# Altium project LED_Driver.PrjPcb
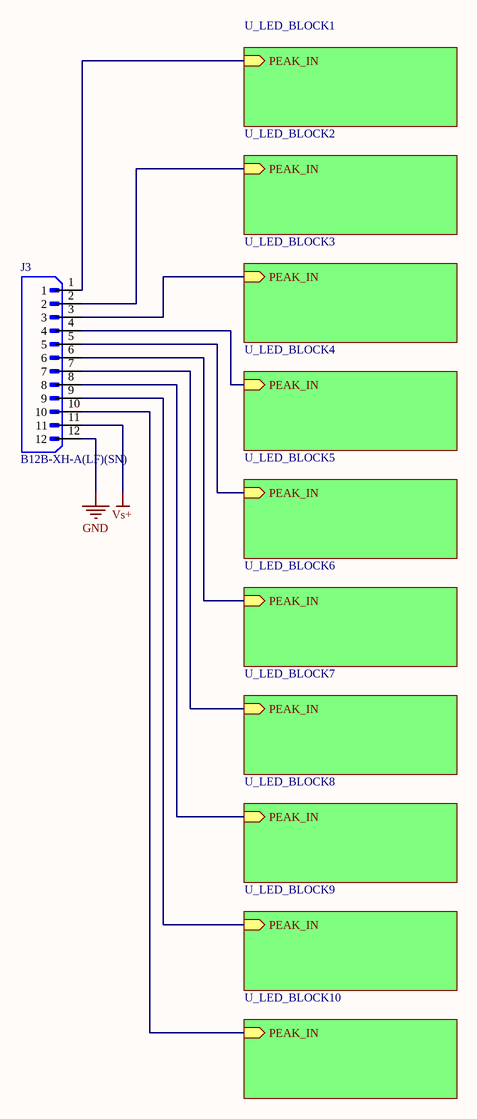
[diagram p0: Drivers_main.SchDoc]
2 sheets, 41 parts. Net scope: hierarchical (ports join the sheet entries above them; power ports are global).
Board file: PCB1.PcbDoc
Sheets:
  Drivers_main.SchDoc
    U_LED_BLOCK2 = LED_BLOCK.SchDoc
    U_LED_BLOCK3 = LED_BLOCK.SchDoc
    U_LED_BLOCK4 = LED_BLOCK.SchDoc
    U_LED_BLOCK1 = LED_BLOCK.SchDoc
    U_LED_BLOCK5 = LED_BLOCK.SchDoc
    U_LED_BLOCK7 = LED_BLOCK.SchDoc
    U_LED_BLOCK8 = LED_BLOCK.SchDoc
    U_LED_BLOCK9 = LED_BLOCK.SchDoc
    U_LED_BLOCK6 = LED_BLOCK.SchDoc
    U_LED_BLOCK10 = LED_BLOCK.SchDoc

## Sheet Drivers_main.SchDoc
size A4 portrait; SheetNumber: 1; SheetTotal: 2

### Parts
J3  B12B-XH-A(LF)(SN)  [JST_B12B-XH-A(LF)(SN)]

### Sub-sheets
U_LED_BLOCK1 = LED_BLOCK.SchDoc: PEAK_IN (in)
U_LED_BLOCK2 = LED_BLOCK.SchDoc: PEAK_IN (in)
U_LED_BLOCK3 = LED_BLOCK.SchDoc: PEAK_IN (in)
U_LED_BLOCK4 = LED_BLOCK.SchDoc: PEAK_IN (in)
U_LED_BLOCK5 = LED_BLOCK.SchDoc: PEAK_IN (in)
U_LED_BLOCK6 = LED_BLOCK.SchDoc: PEAK_IN (in)
U_LED_BLOCK7 = LED_BLOCK.SchDoc: PEAK_IN (in)
U_LED_BLOCK8 = LED_BLOCK.SchDoc: PEAK_IN (in)
U_LED_BLOCK9 = LED_BLOCK.SchDoc: PEAK_IN (in)
U_LED_BLOCK10 = LED_BLOCK.SchDoc: PEAK_IN (in)

### Nets
GND: J3.12
Vs+: J3.11
NetJ3_1: J3.1 ; sheet U_LED_BLOCK1/PEAK_IN
NetJ3_2: J3.2 ; sheet U_LED_BLOCK2/PEAK_IN
NetJ3_3: J3.3 ; sheet U_LED_BLOCK3/PEAK_IN
NetJ3_4: J3.4 ; sheet U_LED_BLOCK4/PEAK_IN
NetJ3_5: J3.5 ; sheet U_LED_BLOCK5/PEAK_IN
NetJ3_6: J3.6 ; sheet U_LED_BLOCK6/PEAK_IN
NetJ3_7: J3.7 ; sheet U_LED_BLOCK7/PEAK_IN
NetJ3_8: J3.8 ; sheet U_LED_BLOCK8/PEAK_IN
NetJ3_9: J3.9 ; sheet U_LED_BLOCK9/PEAK_IN
NetJ3_10: J3.10 ; sheet U_LED_BLOCK10/PEAK_IN

### Library data of the parts
J3 = B12B-XH-A(LF)(SN): Connector Header Through Hole 12 position 0.098 (2.50mm); MF: JST Sales; SnapEDA_Link: https://www.snapeda.com/parts/B12B-XH-A(LF)(SN)/JST+Sales+America+Inc./view-part/?ref=snap; Package: None; Value: *; MP: B12B-XH-A(LF)(SN); Check_prices: https://www.snapeda.com/parts/B12B-XH-A(LF)(SN)/JST+Sales+America+Inc./view-part/?ref=eda

## Sheet LED_BLOCK.SchDoc
size A4; SheetNumber: 2; SheetTotal: 2
Used 10 times, as channels U_LED_BLOCK2, U_LED_BLOCK3, U_LED_BLOCK4, U_LED_BLOCK1, U_LED_BLOCK5, U_LED_BLOCK7, U_LED_BLOCK8, U_LED_BLOCK9, U_LED_BLOCK6, U_LED_BLOCK10. Parts and nets are listed once, with the designators drawn on the sheet.
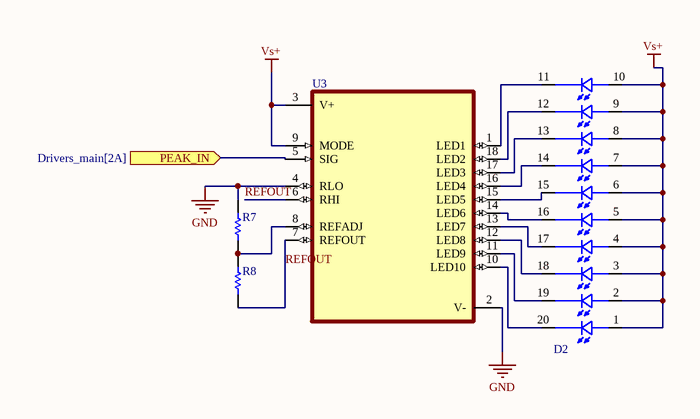
[diagram p1: LED_BLOCK.SchDoc]

### Parts
D2  DC10EWA  [DIP750W50P254L2540H825Q20]  (value not drawn)
R7  MFR-25FBF5210K  [RESA60-630X240]  (value not drawn)
R8  MFR-25FBF5210K  [RESA60-630X240]  (value not drawn)
U3  LM3914N-1  [DIP952W45P254L2336H533Q18]  (value not drawn)

### Ports
PEAK_IN (in, see Drivers_main[2A])

### Nets
GND: R7.2 U3.2(V-) U3.4(RLO)
Vs+: D2.1 D2.2 D2.3 D2.4 D2.5 D2.6 D2.7 D2.8 D2.9 D2.10 U3.3(V+) U3.9(MODE)
PEAK_IN: U3.5(SIG) ; port PEAK_IN
REFOUT: R8.1 U3.6(RHI) U3.7(REFOUT)
NetD2_11: D2.11 U3.1(LED1)
NetD2_12: D2.12 U3.18(LED2)
NetD2_13: D2.13 U3.17(LED3)
NetD2_14: D2.14 U3.16(LED4)
NetD2_15: D2.15 U3.15(LED5)
NetD2_16: D2.16 U3.14(LED6)
NetD2_17: D2.17 U3.13(LED7)
NetD2_18: D2.18 U3.12(LED8)
NetD2_19: D2.19 U3.11(LED9)
NetD2_20: D2.20 U3.10(LED10)
NetR7_1: R7.1 R8.2 U3.8(REFADJ)

### Channels
U_LED_BLOCK2: designators end in _U_LED_BLOCK2; ports PEAK_IN=NetJ3_2
U_LED_BLOCK3: designators end in _U_LED_BLOCK3; ports PEAK_IN=NetJ3_3
U_LED_BLOCK4: designators end in _U_LED_BLOCK4; ports PEAK_IN=NetJ3_4
U_LED_BLOCK1: designators end in _U_LED_BLOCK1; ports PEAK_IN=NetJ3_1
U_LED_BLOCK5: designators end in _U_LED_BLOCK5; ports PEAK_IN=NetJ3_5
U_LED_BLOCK7: designators end in _U_LED_BLOCK7; ports PEAK_IN=NetJ3_7
U_LED_BLOCK8: designators end in _U_LED_BLOCK8; ports PEAK_IN=NetJ3_8
U_LED_BLOCK9: designators end in _U_LED_BLOCK9; ports PEAK_IN=NetJ3_9
U_LED_BLOCK6: designators end in _U_LED_BLOCK6; ports PEAK_IN=NetJ3_6
U_LED_BLOCK10: designators end in _U_LED_BLOCK10; ports PEAK_IN=NetJ3_10

### Library data of the parts
D2 = DC10EWA: LED Circuit Board Indicator Bar - 10 Wide, DIP Red (x 10) Diffused, White 2V 30mA Through Hole; MF: Kingbright; Value: *; SnapEDA_Link: https://www.snapeda.com/parts/DC10EWA/Kingbright/view-part/268697/?ref=snap; Purchase-URL: https://pricing.snapeda.com/search/part/DC10EWA/?ref=eda; Availability: In Stock; Price: None; Package: DIP-20 Kingbright; Check_prices: https://www.snapeda.com/parts/DC10EWA/Kingbright/view-part/268697/?ref=eda; MP: DC10EWA
R7 R8 = CMP-1659-00074-2: Axial Resistor, 10 KOhm, +/- 1%, 0.25 W, -55 to 155 degC, 2-Pin THD, RoHS, Bulk; Manufacturer: Yageo; Temperature Coefficient: 100ppm\/degreesC; Voltage Rating: 250V; Voltage Rating (DC): 200V; Resistance: 10KOhm; Max Power Dissipation: 250mW; Datasheet URL: http://www.yageo.com/documents/recent/Yageo%20LR_MFR_2013.pdf; Packaging: Bulk; RoHSCompliant: True; Mount: ThroughHole; Package Reference: MFR-25; Termination: Axial; Composition: MetalFilm; Number of Terminations: 2; Package Quantity: 200; Mounting Technology: ThroughHole; Length: 0.248inch; Max Operating Temperature: 155degC; Min Operating Temperature: -55degC; Datasheet Version: 04/2013; Lead Free: LeadFree; Manufacturer URL: http://www.yageo.com/; Tolerance: 1%; Power Rating: 250mW; Package Description: 2-Pin Axial Lead, Dia 2.4 mm, Body Length 6.3 mm; Military Standard: Not; Case\/Package: Axial
U3 = LM3914N-1: LED, LCD, Vacuum Fluorescent (VF) Driver 18-PDIP; MF: Texas Instruments; SnapEDA_Link: https://www.snapeda.com/parts/LM3914N-1/Texas+Instruments/view-part/?ref=snap; Package: DIP-18 Texas Instruments; Value: *; MP: LM3914N-1; Check_prices: https://www.snapeda.com/parts/LM3914N-1/Texas+Instruments/view-part/?ref=eda

## Nets that join several sheets
GND: Drivers_main (J3.12), U_LED_BLOCK2 (R7_U_LED_BLOCK2.2 U3_U_LED_BLOCK2.2 U3_U_LED_BLOCK2.4), U_LED_BLOCK3 (R7_U_LED_BLOCK3.2 U3_U_LED_BLOCK3.2 U3_U_LED_BLOCK3.4), U_LED_BLOCK4 (R7_U_LED_BLOCK4.2 U3_U_LED_BLOCK4.2 U3_U_LED_BLOCK4.4), U_LED_BLOCK1 (R7_U_LED_BLOCK1.2 U3_U_LED_BLOCK1.2 U3_U_LED_BLOCK1.4), U_LED_BLOCK5 (R7_U_LED_BLOCK5.2 U3_U_LED_BLOCK5.2 U3_U_LED_BLOCK5.4), U_LED_BLOCK7 (R7_U_LED_BLOCK7.2 U3_U_LED_BLOCK7.2 U3_U_LED_BLOCK7.4), U_LED_BLOCK8 (R7_U_LED_BLOCK8.2 U3_U_LED_BLOCK8.2 U3_U_LED_BLOCK8.4), U_LED_BLOCK9 (R7_U_LED_BLOCK9.2 U3_U_LED_BLOCK9.2 U3_U_LED_BLOCK9.4), U_LED_BLOCK6 (R7_U_LED_BLOCK6.2 U3_U_LED_BLOCK6.2 U3_U_LED_BLOCK6.4), U_LED_BLOCK10 (R7_U_LED_BLOCK10.2 U3_U_LED_BLOCK10.2 U3_U_LED_BLOCK10.4)
Vs+: Drivers_main (J3.11), U_LED_BLOCK2 (12 pins), U_LED_BLOCK3 (12 pins), U_LED_BLOCK4 (12 pins), U_LED_BLOCK1 (12 pins), U_LED_BLOCK5 (12 pins), U_LED_BLOCK7 (12 pins), U_LED_BLOCK8 (12 pins), U_LED_BLOCK9 (12 pins), U_LED_BLOCK6 (12 pins), U_LED_BLOCK10 (12 pins)
NetJ3_1: Drivers_main (J3.1), U_LED_BLOCK1 (U3_U_LED_BLOCK1.5)
NetJ3_2: Drivers_main (J3.2), U_LED_BLOCK2 (U3_U_LED_BLOCK2.5)
NetJ3_3: Drivers_main (J3.3), U_LED_BLOCK3 (U3_U_LED_BLOCK3.5)
NetJ3_4: Drivers_main (J3.4), U_LED_BLOCK4 (U3_U_LED_BLOCK4.5)
NetJ3_5: Drivers_main (J3.5), U_LED_BLOCK5 (U3_U_LED_BLOCK5.5)
NetJ3_6: Drivers_main (J3.6), U_LED_BLOCK6 (U3_U_LED_BLOCK6.5)
NetJ3_7: Drivers_main (J3.7), U_LED_BLOCK7 (U3_U_LED_BLOCK7.5)
NetJ3_8: Drivers_main (J3.8), U_LED_BLOCK8 (U3_U_LED_BLOCK8.5)
NetJ3_9: Drivers_main (J3.9), U_LED_BLOCK9 (U3_U_LED_BLOCK9.5)
NetJ3_10: Drivers_main (J3.10), U_LED_BLOCK10 (U3_U_LED_BLOCK10.5)